# Altium schematic sheet AD_0.SchDoc
size A2; Date: Date; CompanyName: HESSO; Engineer: Name; Address1: Route du Rawyl 47; Address2: 1950 Sion; Address3: Switzerland; DocumentNumber: 1; SheetNumber: 1; SheetTotal: 1; ProjectName: Project Name
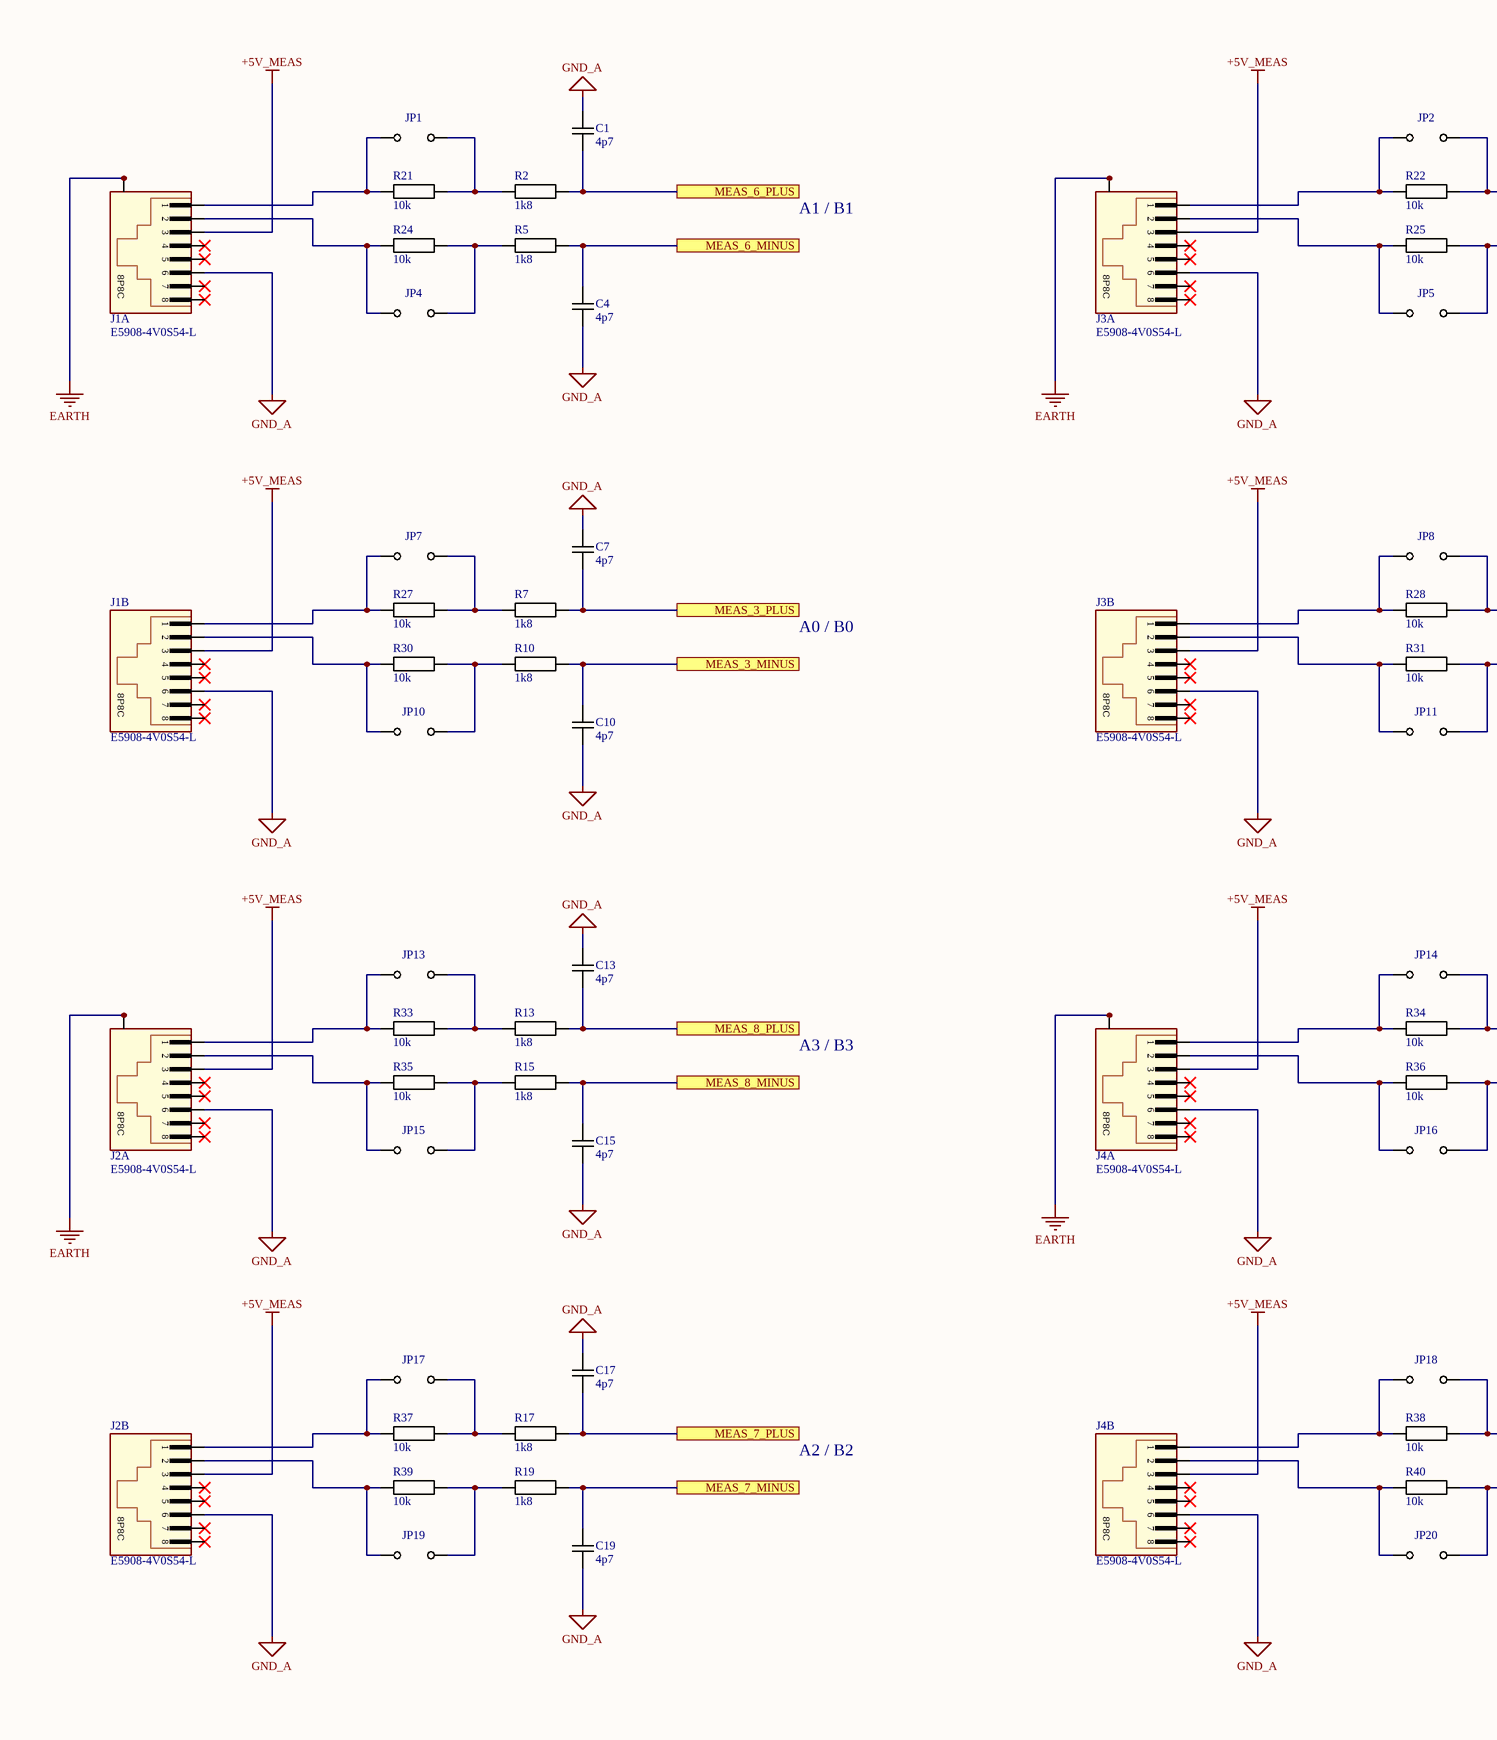
[diagram p0: AD_0.SchDoc, left]
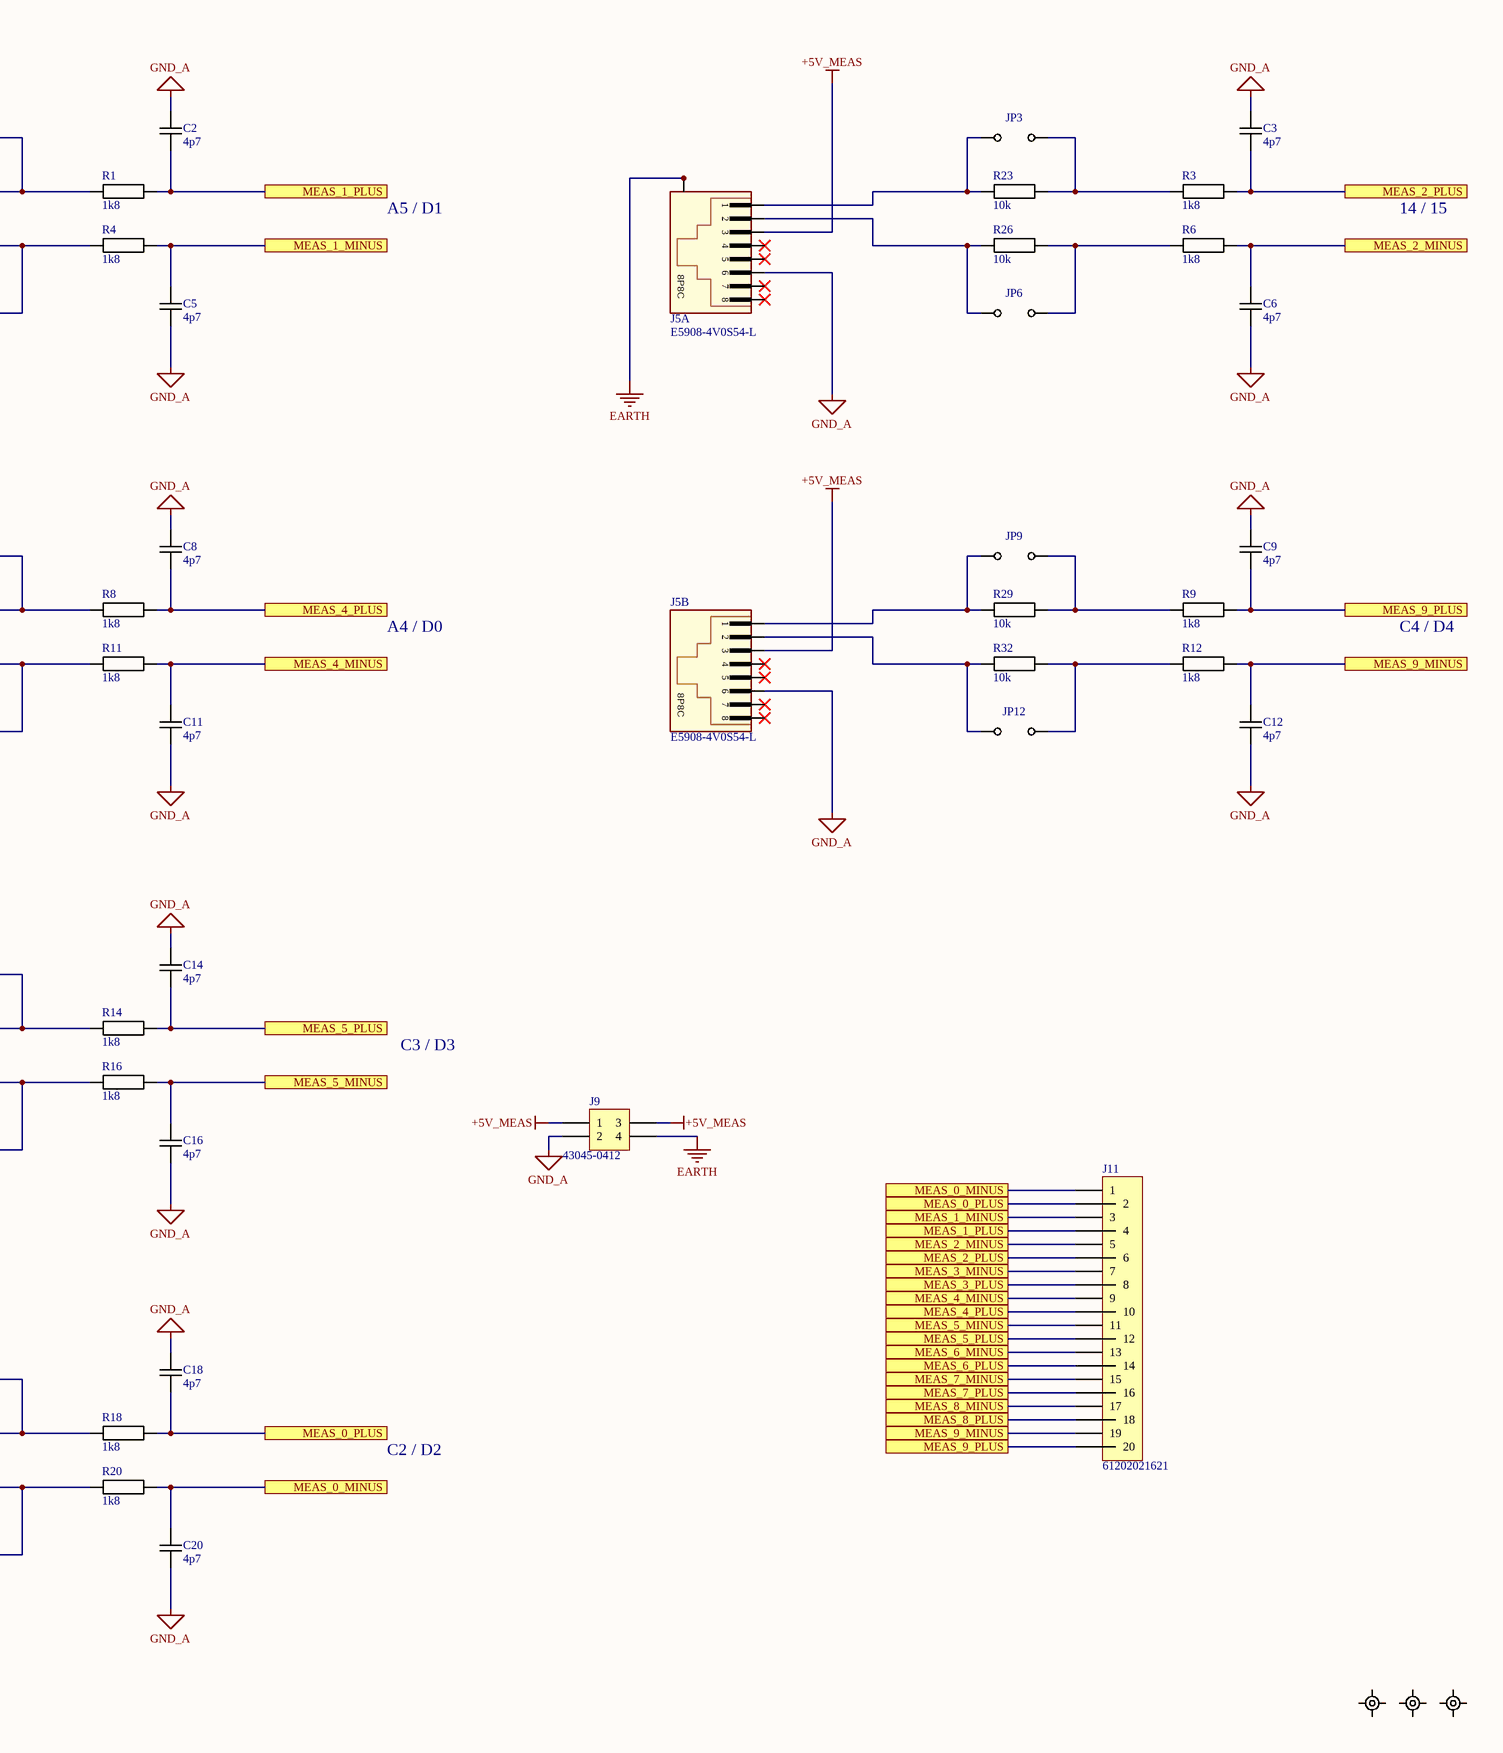
[diagram p1: AD_0.SchDoc, right]

## Parts
C1  4p7  [CAPACITOR 2012 REFLOW]
C2  4p7  [CAPACITOR 2012 REFLOW]
C3  4p7  [CAPACITOR 2012 REFLOW]
C4  4p7  [CAPACITOR 2012 REFLOW]
C5  4p7  [CAPACITOR 2012 REFLOW]
C6  4p7  [CAPACITOR 2012 REFLOW]
C7  4p7  [CAPACITOR 2012 REFLOW]
C8  4p7  [CAPACITOR 2012 REFLOW]
C9  4p7  [CAPACITOR 2012 REFLOW]
C10  4p7  [CAPACITOR 2012 REFLOW]
C11  4p7  [CAPACITOR 2012 REFLOW]
C12  4p7  [CAPACITOR 2012 REFLOW]
C13  4p7  [CAPACITOR 2012 REFLOW]
C14  4p7  [CAPACITOR 2012 REFLOW]
C15  4p7  [CAPACITOR 2012 REFLOW]
C16  4p7  [CAPACITOR 2012 REFLOW]
C17  4p7  [CAPACITOR 2012 REFLOW]
C18  4p7  [CAPACITOR 2012 REFLOW]
C19  4p7  [CAPACITOR 2012 REFLOW]
C20  4p7  [CAPACITOR 2012 REFLOW]
J1  E5908-4V0S54-L  [RJ45 8P8C PULSE E5908-4V0S54-L]  (parts A,B of 2)
J2  E5908-4V0S54-L  [RJ45 8P8C PULSE E5908-4V0S54-L]  (parts A,B of 2)
J3  E5908-4V0S54-L  [RJ45 8P8C PULSE E5908-4V0S54-L]  (parts A,B of 2)
J4  E5908-4V0S54-L  [RJ45 8P8C PULSE E5908-4V0S54-L]  (parts A,B of 2)
J5  E5908-4V0S54-L  [RJ45 8P8C PULSE E5908-4V0S54-L]  (parts A,B of 2)
J9  43045-0412  [MOLEX 43045-0412]
J11  61202021621  [FlatCable2x10 2.54MM Straight TH]
JP1  890-18-036-10-803  [JUMPER2 TH]  (value not drawn)
JP2  890-18-036-10-803  [JUMPER2 TH]  (value not drawn)
JP3  890-18-036-10-803  [JUMPER2 TH]  (value not drawn)
JP4  890-18-036-10-803  [JUMPER2 TH]  (value not drawn)
JP5  890-18-036-10-803  [JUMPER2 TH]  (value not drawn)
JP6  890-18-036-10-803  [JUMPER2 TH]  (value not drawn)
JP7  890-18-036-10-803  [JUMPER2 TH]  (value not drawn)
JP8  890-18-036-10-803  [JUMPER2 TH]  (value not drawn)
JP9  890-18-036-10-803  [JUMPER2 TH]  (value not drawn)
JP10  890-18-036-10-803  [JUMPER2 TH]  (value not drawn)
JP11  890-18-036-10-803  [JUMPER2 TH]  (value not drawn)
JP12  890-18-036-10-803  [JUMPER2 TH]  (value not drawn)
JP13  890-18-036-10-803  [JUMPER2 TH]  (value not drawn)
JP14  890-18-036-10-803  [JUMPER2 TH]  (value not drawn)
JP15  890-18-036-10-803  [JUMPER2 TH]  (value not drawn)
JP16  890-18-036-10-803  [JUMPER2 TH]  (value not drawn)
JP17  890-18-036-10-803  [JUMPER2 TH]  (value not drawn)
JP18  890-18-036-10-803  [JUMPER2 TH]  (value not drawn)
JP19  890-18-036-10-803  [JUMPER2 TH]  (value not drawn)
JP20  890-18-036-10-803  [JUMPER2 TH]  (value not drawn)
R1  1k8  [RESISTOR 2012 REFLOW]
R2  1k8  [RESISTOR 2012 REFLOW]
R3  1k8  [RESISTOR 2012 REFLOW]
R4  1k8  [RESISTOR 2012 REFLOW]
R5  1k8  [RESISTOR 2012 REFLOW]
R6  1k8  [RESISTOR 2012 REFLOW]
R7  1k8  [RESISTOR 2012 REFLOW]
R8  1k8  [RESISTOR 2012 REFLOW]
R9  1k8  [RESISTOR 2012 REFLOW]
R10  1k8  [RESISTOR 2012 REFLOW]
R11  1k8  [RESISTOR 2012 REFLOW]
R12  1k8  [RESISTOR 2012 REFLOW]
R13  1k8  [RESISTOR 2012 REFLOW]
R14  1k8  [RESISTOR 2012 REFLOW]
R15  1k8  [RESISTOR 2012 REFLOW]
R16  1k8  [RESISTOR 2012 REFLOW]
R17  1k8  [RESISTOR 2012 REFLOW]
R18  1k8  [RESISTOR 2012 REFLOW]
R19  1k8  [RESISTOR 2012 REFLOW]
R20  1k8  [RESISTOR 2012 REFLOW]
R21  10k  [RESISTOR 2012 REFLOW]
R22  10k  [RESISTOR 2012 REFLOW]
R23  10k  [RESISTOR 2012 REFLOW]
R24  10k  [RESISTOR 2012 REFLOW]
R25  10k  [RESISTOR 2012 REFLOW]
R26  10k  [RESISTOR 2012 REFLOW]
R27  10k  [RESISTOR 2012 REFLOW]
R28  10k  [RESISTOR 2012 REFLOW]
R29  10k  [RESISTOR 2012 REFLOW]
R30  10k  [RESISTOR 2012 REFLOW]
R31  10k  [RESISTOR 2012 REFLOW]
R32  10k  [RESISTOR 2012 REFLOW]
R33  10k  [RESISTOR 2012 REFLOW]
R34  10k  [RESISTOR 2012 REFLOW]
R35  10k  [RESISTOR 2012 REFLOW]
R36  10k  [RESISTOR 2012 REFLOW]
R37  10k  [RESISTOR 2012 REFLOW]
R38  10k  [RESISTOR 2012 REFLOW]
R39  10k  [RESISTOR 2012 REFLOW]
R40  10k  [RESISTOR 2012 REFLOW]
Z1  1 - 3  [FIDUCIAL]  (value not drawn)
Z2  1 - 3  [FIDUCIAL]  (value not drawn)
Z3  1 - 3  [FIDUCIAL]  (value not drawn)

## Ports
MEAS_0_MINUS, MEAS_0_PLUS, MEAS_1_MINUS, MEAS_1_PLUS, MEAS_2_MINUS, MEAS_2_PLUS, MEAS_3_MINUS, MEAS_3_PLUS, MEAS_4_MINUS, MEAS_4_PLUS, MEAS_5_MINUS, MEAS_5_PLUS, MEAS_6_MINUS, MEAS_6_PLUS, MEAS_7_MINUS, MEAS_7_PLUS, MEAS_8_MINUS, MEAS_8_PLUS, MEAS_9_MINUS, MEAS_9_PLUS

## Nets
+5V_MEAS: J1.3A J1.3B J2.3A J2.3B J3.3A J3.3B J4.3A J4.3B J5.3A J5.3B J9.1 J9.3
EARTH: J1.9 J1.10 J1.11 J1.12(SHIELD) J2.9 J2.10 J2.11 J2.12(SHIELD) J3.9 J3.10 J3.11 J3.12(SHIELD) J4.9 J4.10 J4.11 J4.12(SHIELD) J5.9 J5.10 J5.11 J5.12(SHIELD) J9.4
GND_A: C1.2 C2.2 C3.2 C4.1 C5.1 C6.1 C7.2 C8.2 C9.2 C10.1 C11.1 C12.1 C13.2 C14.2 C15.1 C16.1 C17.2 C18.2 C19.1 C20.1 J1.6A J1.6B J2.6A J2.6B J3.6A J3.6B J4.6A J4.6B J5.6A J5.6B J9.2
MEAS_0_MINUS: C20.2 J11.1 R20.2 ; port MEAS_0_MINUS
MEAS_0_PLUS: C18.1 J11.2 R18.2 ; port MEAS_0_PLUS
MEAS_1_MINUS: C5.2 J11.3 R4.2 ; port MEAS_1_MINUS
MEAS_1_PLUS: C2.1 J11.4 R1.2 ; port MEAS_1_PLUS
MEAS_2_MINUS: C6.2 J11.5 R6.2 ; port MEAS_2_MINUS
MEAS_2_PLUS: C3.1 J11.6 R3.2 ; port MEAS_2_PLUS
MEAS_3_MINUS: C10.2 J11.7 R10.2 ; port MEAS_3_MINUS
MEAS_3_PLUS: C7.1 J11.8 R7.2 ; port MEAS_3_PLUS
MEAS_4_MINUS: C11.2 J11.9 R11.2 ; port MEAS_4_MINUS
MEAS_4_PLUS: C8.1 J11.10 R8.2 ; port MEAS_4_PLUS
MEAS_5_MINUS: C16.2 J11.11 R16.2 ; port MEAS_5_MINUS
MEAS_5_PLUS: C14.1 J11.12 R14.2 ; port MEAS_5_PLUS
MEAS_6_MINUS: C4.2 J11.13 R5.2 ; port MEAS_6_MINUS
MEAS_6_PLUS: C1.1 J11.14 R2.2 ; port MEAS_6_PLUS
MEAS_7_MINUS: C19.2 J11.15 R19.2 ; port MEAS_7_MINUS
MEAS_7_PLUS: C17.1 J11.16 R17.2 ; port MEAS_7_PLUS
MEAS_8_MINUS: C15.2 J11.17 R15.2 ; port MEAS_8_MINUS
MEAS_8_PLUS: C13.1 J11.18 R13.2 ; port MEAS_8_PLUS
MEAS_9_MINUS: C12.2 J11.19 R12.2 ; port MEAS_9_MINUS
MEAS_9_PLUS: C9.1 J11.20 R9.2 ; port MEAS_9_PLUS
NetJ1_1A: J1.1A JP1.1 R21.1
NetJ1_1B: J1.1B JP7.1 R27.1
NetJ1_2A: J1.2A JP4.1 R24.2
NetJ1_2B: J1.2B JP10.1 R30.2
NetJ2_1A: J2.1A JP13.1 R33.1
NetJ2_1B: J2.1B JP17.1 R37.1
NetJ2_2A: J2.2A JP15.1 R35.2
NetJ2_2B: J2.2B JP19.1 R39.2
NetJ3_1A: J3.1A JP2.1 R22.1
NetJ3_1B: J3.1B JP8.1 R28.1
NetJ3_2A: J3.2A JP5.1 R25.2
NetJ3_2B: J3.2B JP11.1 R31.2
NetJ4_1A: J4.1A JP14.1 R34.1
NetJ4_1B: J4.1B JP18.1 R38.1
NetJ4_2A: J4.2A JP16.1 R36.2
NetJ4_2B: J4.2B JP20.1 R40.2
NetJ5_1A: J5.1A JP3.1 R23.1
NetJ5_1B: J5.1B JP9.1 R29.1
NetJ5_2A: J5.2A JP6.1 R26.2
NetJ5_2B: J5.2B JP12.1 R32.2
NetJP1_2: JP1.2 R2.1 R21.2
NetJP2_2: JP2.2 R1.1 R22.2
NetJP3_2: JP3.2 R3.1 R23.2
NetJP4_2: JP4.2 R5.1 R24.1
NetJP5_2: JP5.2 R4.1 R25.1
NetJP6_2: JP6.2 R6.1 R26.1
NetJP7_2: JP7.2 R7.1 R27.2
NetJP8_2: JP8.2 R8.1 R28.2
NetJP9_2: JP9.2 R9.1 R29.2
NetJP10_2: JP10.2 R10.1 R30.1
NetJP11_2: JP11.2 R11.1 R31.1
NetJP12_2: JP12.2 R12.1 R32.1
NetJP13_2: JP13.2 R13.1 R33.2
NetJP14_2: JP14.2 R14.1 R34.2
NetJP15_2: JP15.2 R15.1 R35.1
NetJP16_2: JP16.2 R16.1 R36.1
NetJP17_2: JP17.2 R17.1 R37.2
NetJP18_2: JP18.2 R18.1 R38.2
NetJP19_2: JP19.2 R19.1 R39.1
NetJP20_2: JP20.2 R20.1 R40.1

Not connected (* = marked no-connect by the designer): J1 4A* 4B* 5A* 5B* 7A* 7B* 8A* 8B*; J2 4A* 4B* 5A* 5B* 7A* 7B* 8A* 8B*; J3 4A* 4B* 5A* 5B* 7A* 7B* 8A* 8B*; J4 4A* 4B* 5A* 5B* 7A* 7B* 8A* 8B*; J5 4A* 4B* 5A* 5B* 7A* 7B* 8A* 8B*

## Notes on the sheet
- A1 / B1
- A5 / D1
- 14 / 15
- A0 / B0
- A4 / D0
- C4 / D4
- A3 / B3
- C3 / D3
- A2 / B2
- C2 / D2
- Date :
- Revision :
- Sheet
- of
- Design by :
- (in symbol RJ45 8P8C PULSE E5908-4V0S54-L, part A) 1; 2; 3; 4; 5; 8P8C; 6; 7; 8
- (in symbol RJ45 8P8C PULSE E5908-4V0S54-L, part B) 1; 2; 3; 4; 5; 8P8C; 6; 7; 8

## Library data of the parts
C1-C20 = Capacitor: Capacitor X7R 50V 2012(0805); Value: 4p7
J1-J5 = RJ45 8P8C PULSE E5908-4V0S54-L: RJ45 2X1 8P8C Ethernet Connectors CONN 30u Au THT; Manufacturer: Pulse Electronics; Value: E5908-4V0S54-L; Mouser No.: 673-E5908-4V0S54-L
J9 = MOLEX 43045-0412: Micro-Fit 3.0 Vertical Header, 3.00mm Pitch, Dual Row, 4 Circuits; Manufacturer: Molex; Mouser No.: 538-43045-0412; Value: 43045-0412
J11 = FlatCable2x10: FlatCable2x10 2.54mm Straight TH; Manufacturer: Wurth Elektronik; Mouser No.: 710-61202021621; Value: 61202021621
JP1-JP20 = JUMPER 2 POS: Manufacturer: PRECI-DIP; Value: 890-18-036-10-803; Distrelec No.: 143-83-920
R1-R40 = Resistor: Resistor 1% 50V 125mW 2012(0805)
  R1-R20: Value: 1k8
  R21-R40: Value: 10k
Z1-Z3 = FIDUCIAL: FIDUCIAL Din 1mm Dout 3mm; Value: 1 - 3